# Altium schematic sheet Motor Driver.SchDoc
size B; SheetNumber: 3; SheetTotal: 4
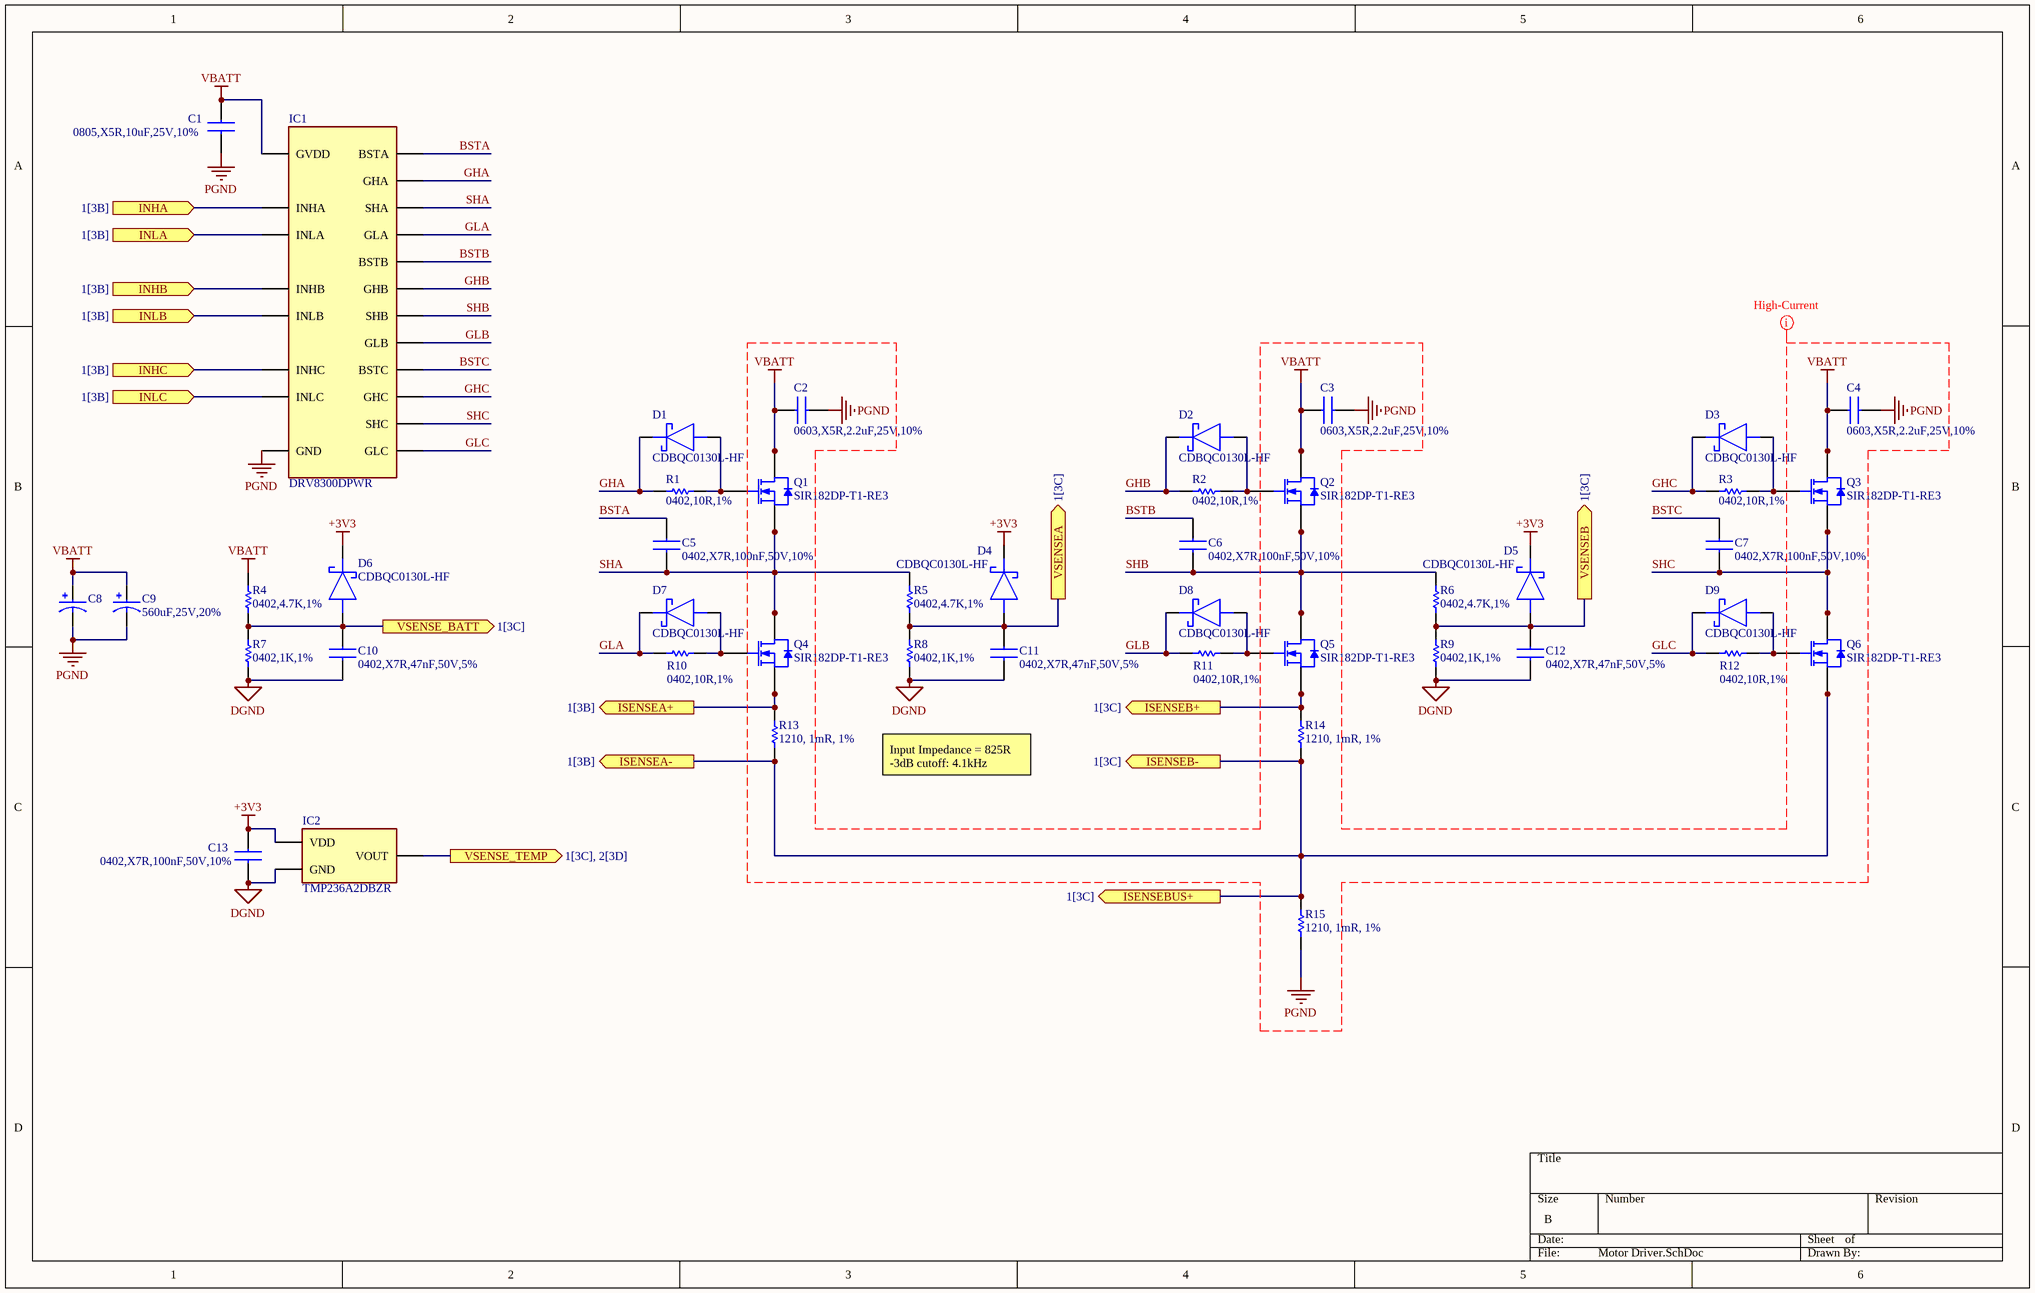
[diagram p0: Motor Driver.SchDoc]

## Parts
C1  0805,X5R,10uF,25V,10%  [CAPC2012X145N]
C2  0603,X5R,2.2uF,25V,10%  [CAPC1608X90N]
C3  0603,X5R,2.2uF,25V,10%  [CAPC1608X90N]
C4  0603,X5R,2.2uF,25V,10%  [CAPC1608X90N]
C5  0402,X7R,100nF,50V,10%  [CAPC1005X55N]
C6  0402,X7R,100nF,50V,10%  [CAPC1005X55N]
C7  0402,X7R,100nF,50V,10%  [CAPC1005X55N]
C8  560uF,25V,20%  [CAP-SMD_BD8.0-L8.3-W8.3-FD]  (value not drawn)
C9  560uF,25V,20%  [CAP-SMD_BD8.0-L8.3-W8.3-FD]
C10  0402,X7R,47nF,50V,5%  [CAPC1005X55N]
C11  0402,X7R,47nF,50V,5%  [CAPC1005X55N]
C12  0402,X7R,47nF,50V,5%  [CAPC1005X55N]
C13  0402,X7R,100nF,50V,10%  [CAPC1005X55N]
D1  CDBQC0130L-HF  [CDBQC0130LHF]
D2  CDBQC0130L-HF  [CDBQC0130LHF]
D3  CDBQC0130L-HF  [CDBQC0130LHF]
D4  CDBQC0130L-HF  [CDBQC0130LHF]
D5  CDBQC0130L-HF  [CDBQC0130LHF]
D6  CDBQC0130L-HF  [CDBQC0130LHF]
D7  CDBQC0130L-HF  [CDBQC0130LHF]
D8  CDBQC0130L-HF  [CDBQC0130LHF]
D9  CDBQC0130L-HF  [CDBQC0130LHF]
IC1  DRV8300DPWR  [SOP65P640X120-20N]
IC2  TMP236A2DBZR  [SOT95P237X112-3N]
Q1  SIR182DP-T1-RE3  [POWERPAK-SO-8_L5.9-W4.9-P1.27-LS6.2-BL]
Q2  SIR182DP-T1-RE3  [POWERPAK-SO-8_L5.9-W4.9-P1.27-LS6.2-BL]
Q3  SIR182DP-T1-RE3  [POWERPAK-SO-8_L5.9-W4.9-P1.27-LS6.2-BL]
Q4  SIR182DP-T1-RE3  [POWERPAK-SO-8_L5.9-W4.9-P1.27-LS6.2-BL]
Q5  SIR182DP-T1-RE3  [POWERPAK-SO-8_L5.9-W4.9-P1.27-LS6.2-BL]
Q6  SIR182DP-T1-RE3  [POWERPAK-SO-8_L5.9-W4.9-P1.27-LS6.2-BL]
R1  0402,10R,1%  [RESC1005X40N]
R2  0402,10R,1%  [RESC1005X40N]
R3  0402,10R,1%  [RESC1005X40N]
R4  0402,4.7K,1%  [RESC1005X40N]
R5  0402,4.7K,1%  [RESC1005X40N]
R6  0402,4.7K,1%  [RESC1005X40N]
R7  0402,1K,1%  [RESC1005X40N]
R8  0402,1K,1%  [RESC1005X40N]
R9  0402,1K,1%  [RESC1005X40N]
R10  0402,10R,1%  [RESC1005X40N]
R11  0402,10R,1%  [RESC1005X40N]
R12  0402,10R,1%  [RESC1005X40N]
R13  1210, 1mR, 1%  [R1210]
R14  1210, 1mR, 1%  [R1210]
R15  1210, 1mR, 1%  [R1210]

## Ports
INHA (in, see 1[3B]), INHB (in, see 1[3B]), INHC (in, see 1[3B]), INLA (in, see 1[3B]), INLB (in, see 1[3B]), INLC (in, see 1[3B]), ISENSEA+ (out, see 1[3B]), ISENSEA- (out, see 1[3B]), ISENSEB+ (out, see 1[3C]), ISENSEB- (out, see 1[3C]), ISENSEBUS+ (out, see 1[3C]), VSENSE_BATT (out, see 1[3C]), VSENSE_TEMP (out, see 1[3C], 2[3D]), VSENSEA (out, see 1[3C]), VSENSEB (out, see 1[3C])

## Nets
+3V3: C13.2 D4.1(K) D5.1(K) D6.1(K) IC2.1(VDD)
DGND: C10.1 C11.1 C12.1 C13.1 IC2.3(GND) R7.1 R8.1 R9.1
PGND: C1.2 C2.2 C3.2 C4.2 C8.2 C9.2 IC1.8(GND) R15.1
VBATT: C1.1 C2.1 C3.1 C4.1 C8.1 C9.1 IC1.7(GVDD) Q1.5(D) Q1.6(D) Q1.7(D) Q1.8(D) Q2.5(D) Q2.6(D) Q2.7(D) Q2.8(D) Q3.5(D) Q3.6(D) Q3.7(D) Q3.8(D) R4.2
BSTA: C5.2 IC1.20(BSTA)
BSTB: C6.2 IC1.17(BSTB)
BSTC: C7.2 IC1.14(BSTC)
GHA: D1.1(K) IC1.19(GHA) R1.1
GHB: D2.1(K) IC1.16(GHB) R2.1
GHC: D3.1(K) IC1.13(GHC) R3.1
GLA: D7.1(K) IC1.11(GLA) R10.1
GLB: D8.1(K) IC1.10(GLB) R11.1
GLC: D9.1(K) IC1.9(GLC) R12.1
INHA: IC1.1(INHA) ; port INHA
INHB: IC1.2(INHB) ; port INHB
INHC: IC1.3(INHC) ; port INHC
INLA: IC1.4(INLA) ; port INLA
INLB: IC1.5(INLB) ; port INLB
INLC: IC1.6(INLC) ; port INLC
ISENSEA+: Q4.1(S) Q4.2(S) Q4.3(S) R13.2 ; port ISENSEA+
ISENSEA-: Q6.1(S) Q6.2(S) Q6.3(S) R13.1 R14.1 R15.2 ; port ISENSEA-, port ISENSEB-, port ISENSEBUS+
ISENSEB+: Q5.1(S) Q5.2(S) Q5.3(S) R14.2 ; port ISENSEB+
SHA: C5.1 IC1.18(SHA) Q1.1(S) Q1.2(S) Q1.3(S) Q4.5(D) Q4.6(D) Q4.7(D) Q4.8(D) R5.2
SHB: C6.1 IC1.15(SHB) Q2.1(S) Q2.2(S) Q2.3(S) Q5.5(D) Q5.6(D) Q5.7(D) Q5.8(D) R6.2
SHC: C7.1 IC1.12(SHC) Q3.1(S) Q3.2(S) Q3.3(S) Q6.5(D) Q6.6(D) Q6.7(D) Q6.8(D)
VSENSE_BATT: C10.2 D6.2(A) R4.1 R7.2 ; port VSENSE_BATT
VSENSE_TEMP: IC2.2(VOUT) ; port VSENSE_TEMP
VSENSEA: C11.2 D4.2(A) R5.1 R8.2 ; port VSENSEA
VSENSEB: C12.2 D5.2(A) R6.1 R9.2 ; port VSENSEB
NetD1_2: D1.2(A) Q1.4(G) R1.2
NetD2_2: D2.2(A) Q2.4(G) R2.2
NetD3_2: D3.2(A) Q3.4(G) R3.2
NetD7_2: D7.2(A) Q4.4(G) R10.2
NetD8_2: D8.2(A) Q5.4(G) R11.2
NetD9_2: D9.2(A) Q6.4(G) R12.2

## Layout directives
net class High-Current: PGND, VBATT

## Notes on the sheet
- Input Impedance = 825R
  -3dB cutoff: 4.1kHz

## Library data of the parts
C1 = CC0805KKX5R8BB106: 10 µF ±10% 25V Ceramic Capacitor X5R 0805 (2012 Metric); Manufacturer_Name: YAGEO; Datasheet Link: https://www.yageo.com/upload/media/product/productsearch/datasheet/mlcc/UPY-GPHC_X5R_4V-to-50V_27.pdf; Height: 1.45mm; Manufacturer_Part_Number: CC0805KKX5R8BB106; Mouser Part Number: 603-CC805KKX5R8BB106; Mouser Price/Stock: https://www.mouser.co.uk/ProductDetail/YAGEO/CC0805KKX5R8BB106?qs=57cj7OiSijm89pM64t1AGQ%3D%3D; Arrow Part Number: CC0805KKX5R8BB106; Arrow Price/Stock: https://www.arrow.com/en/products/cc0805kkx5r8bb106/yageo?utm_currency=USD&region=nac; LCSC Part #: C89831
C2-C4 = CC0603KRX5R8BB225: 2.2 µF ±10% 25V Ceramic Capacitor X5R 0603 (1608 Metric); Manufacturer_Name: YAGEO; Manufacturer_Part_Number: CC0603JRNPO9BN560; Datasheet Link: https://www.yageo.com/upload/media/product/app/datasheet/mlcc/upy-gphc_x7r_6_3v-to-250v.pdf; Height: 0.95mm; Mouser Part Number: 603-CC603KRX7R9BB105; Mouser Price/Stock: https://www.mouser.co.uk/ProductDetail/YAGEO/CC0603KRX7R9BB105?qs=6wERJjOp3mmF17%252BYi8cgJQ%3D%3D; Arrow Part Number: CC0603KRX7R9BB105; Arrow Price/Stock: https://www.arrow.com/en/products/cc0603krx7r9bb105/yageo?utm_currency=USD&region=nac; LCSC Part #: C309478; Manu Part #: CC0603KRX5R8BB225
C5-C7 C13 = CC0402KRX7R9BB104: 0.1 µF ±10% 50V Ceramic Capacitor X7R 0402 (1005 Metric); Manufacturer_Name: YAGEO; Datasheet Link: https://4donline.ihs.com/images/VipMasterIC/IC/YAGO/YAGO-S-A0003557223/YAGO-S-A0003557223-1.pdf?hkey=6D3A4C79FDBF58556ACFDE234799DDF0; Height: 0.55mm; Manufacturer_Part_Number: CC0402KRX7R9BB104; Mouser Part Number: 603-CC402KRX7R9BB104; Mouser Price/Stock: https://www.mouser.co.uk/ProductDetail/YAGEO/CC0402KRX7R9BB104?qs=vRUrOTOuwyGrQb4GbTIVjw%3D%3D; Arrow Part Number: CC0402KRX7R9BB104; Arrow Price/Stock: https://www.arrow.com/en/products/cc0402krx7r9bb104/yageo?utm_currency=USD&region=europe; Manu Part #: CC0402KRX7R9BB104; LCSC Part #: C131394
C8 C9 = HV1E567M0810PZ: 25V 560uF ±20% SMD,D8xL10.5mm Aluminum - Polymer Capacitors RoHS; LCSC Part #: C5246548; Manu Part #: HV1E567M0810PZ
C10-C12 = CC0402JRX7R9BB473: 0.047 µF ±5% 50V Ceramic Capacitor X7R 0402 (1005 Metric); Manufacturer_Name: YAGEO; Datasheet Link: https://4donline.ihs.com/images/VipMasterIC/IC/YAGO/YAGO-S-A0003557223/YAGO-S-A0003557223-1.pdf?hkey=6D3A4C79FDBF58556ACFDE234799DDF0; Height: 0.55mm; Manufacturer_Part_Number: CC0402JRX7R9BB473; Mouser Part Number: 603-CC402KRX7R9BB104; Mouser Price/Stock: https://www.mouser.co.uk/ProductDetail/YAGEO/CC0402KRX7R9BB104?qs=vRUrOTOuwyGrQb4GbTIVjw%3D%3D; Arrow Part Number: CC0402KRX7R9BB104; Arrow Price/Stock: https://www.arrow.com/en/products/cc0402krx7r9bb104/yageo?utm_currency=USD&region=europe; Manu Part #: CC0402JRX7R9BB473; LCSC Part #: C576715
D1-D9 = CDBQC0130L-HF: Diode 30 V 100mA Surface Mount 0402C/SOD-923F; Manufacturer_Name: Comchip Technology; Datasheet Link: https://www.comchiptech.com/admin/files/product/CDBQC0130L-HF%20RevB681116.pdf; Height: 0.55mm; Manufacturer_Part_Number: CDBQC0130L-HF; Mouser Part Number: 750-CDBQC0130L-HF; Mouser Price/Stock: https://www.mouser.co.uk/ProductDetail/Comchip-Technology/CDBQC0130L-HF?qs=YlpJWyuQ3PMlIcuiqEd%2FoA%3D%3D; Arrow Part Number: CDBQC0130L-HF; Arrow Price/Stock: https://www.arrow.com/en/products/cdbqc0130l-hf/comchip-technology?utm_currency=USD&region=nac; Manu Part #: CDBQC0130L-HF; LCSC Part #: C2886012
IC1 = DRV8300DPWR: TSSOP-20 Brushless DC (BLDC) Motor Driver ROHS; Manufacturer_Name: Texas Instruments; Height: 1.2mm; Manufacturer_Part_Number: DRV8300DPWR; Mouser Part Number: 595-DRV8300DPWR; Mouser Price/Stock: https://www.mouser.co.uk/ProductDetail/Texas-Instruments/DRV8300DPWR?qs=eP2BKZSCXI6qJbKdYnGwBg%3D%3D; Arrow Part Number: DRV8300DPWR; Arrow Price/Stock: https://www.arrow.com/en/products/drv8300dpwr/texas-instruments?utm_currency=USD&region=nac; LCSC Part #: C3036056
IC2 = TMP236A2DBZR: Low-power and high-precision analog output temperature sensor; Manufacturer_Name: Texas Instruments; Datasheet Link: http://www.ti.com/lit/gpn/tmp236; Height: 1.12mm; Manufacturer_Part_Number: TMP236A2DBZR; Mouser Part Number: 595-TMP236A2DBZR; Mouser Price/Stock: https://www.mouser.co.uk/ProductDetail/Texas-Instruments/TMP236A2DBZR?qs=lc2O%252BfHJPVanftlPgPUvow%3D%3D; Arrow Part Number: TMP236A2DBZR; Arrow Price/Stock: https://www.arrow.com/en/products/tmp236a2dbzr/texas-instruments?region=nac; LCSC Part #: C2859666
Q1-Q6 = SIR182DP-T1-RE3: 60V 117A 2.8mΩ@10V,15A 2V 1 N-Channel PowerPAKSO-8 MOSFETs ROHS; LCSC Part #: C467943
R1-R3 R10-R12 = RC0402FR-0710RL: 10 Ohms ±1% 0.063W, 1/16W Chip Resistor 0402 (1005 Metric) Moisture Resistant Thick Film; Manufacturer_Name: YAGEO; Manufacturer_Part_Number: RC0402FR-0710KL; Datasheet Link: https://componentsearchengine.com/Datasheets/2/RC0402FR-0710KL.pdf; Height: 0.4mm; Mouser Part Number: 603-RC0402FR-0710KL; Mouser Price/Stock: https://www.mouser.co.uk/ProductDetail/YAGEO/RC0402FR-0710KL?qs=I1mnnYJTTsxUoNwrUsQExA%3D%3D; Arrow Part Number: RC0402FR-0710KL; Arrow Price/Stock: https://www.arrow.com/en/products/rc0402fr-0710kl/yageo?region=europe; Manu Part #: RC0402FR-0710RL; LCSC Part #: C138066
R4-R6 = RC0402FR-074K7L: 4.7 kOhms ±1% 0.063W, 1/16W Chip Resistor 0402 (1005 Metric) Moisture Resistant Thick Film; Manufacturer_Name: YAGEO; Manufacturer_Part_Number: RC0402FR-0710KL; Datasheet Link: https://componentsearchengine.com/Datasheets/2/RC0402FR-0710KL.pdf; Height: 0.4mm; Mouser Part Number: 603-RC0402FR-0710KL; Mouser Price/Stock: https://www.mouser.co.uk/ProductDetail/YAGEO/RC0402FR-0710KL?qs=I1mnnYJTTsxUoNwrUsQExA%3D%3D; Arrow Part Number: RC0402FR-0710KL; Arrow Price/Stock: https://www.arrow.com/en/products/rc0402fr-0710kl/yageo?region=europe; Manu Part #: RC0402FR-074K7L; LCSC Part #: C105871
R7-R9 = RC0402FR-071KL: 1 kOhms ±1% 0.063W, 1/16W Chip Resistor 0402 (1005 Metric) Moisture Resistant Thick Film; Manufacturer_Name: YAGEO; Manufacturer_Part_Number: RC0402FR-0710KL; Datasheet Link: https://componentsearchengine.com/Datasheets/2/RC0402FR-0710KL.pdf; Height: 0.4mm; Mouser Part Number: 603-RC0402FR-0710KL; Mouser Price/Stock: https://www.mouser.co.uk/ProductDetail/YAGEO/RC0402FR-0710KL?qs=I1mnnYJTTsxUoNwrUsQExA%3D%3D; Arrow Part Number: RC0402FR-0710KL; Arrow Price/Stock: https://www.arrow.com/en/products/rc0402fr-0710kl/yageo?region=europe; Manu Part #: RC0402FR-071KL; LCSC Part #: C106235
R13-R15 = PMR25HZPFV1L00: 1W 1mΩ Current Sense Resistor ±100ppm/℃ ±1% 1210 Current Sense Resistors / Shunt Resistors ROHS; LCSC Part #: C509735